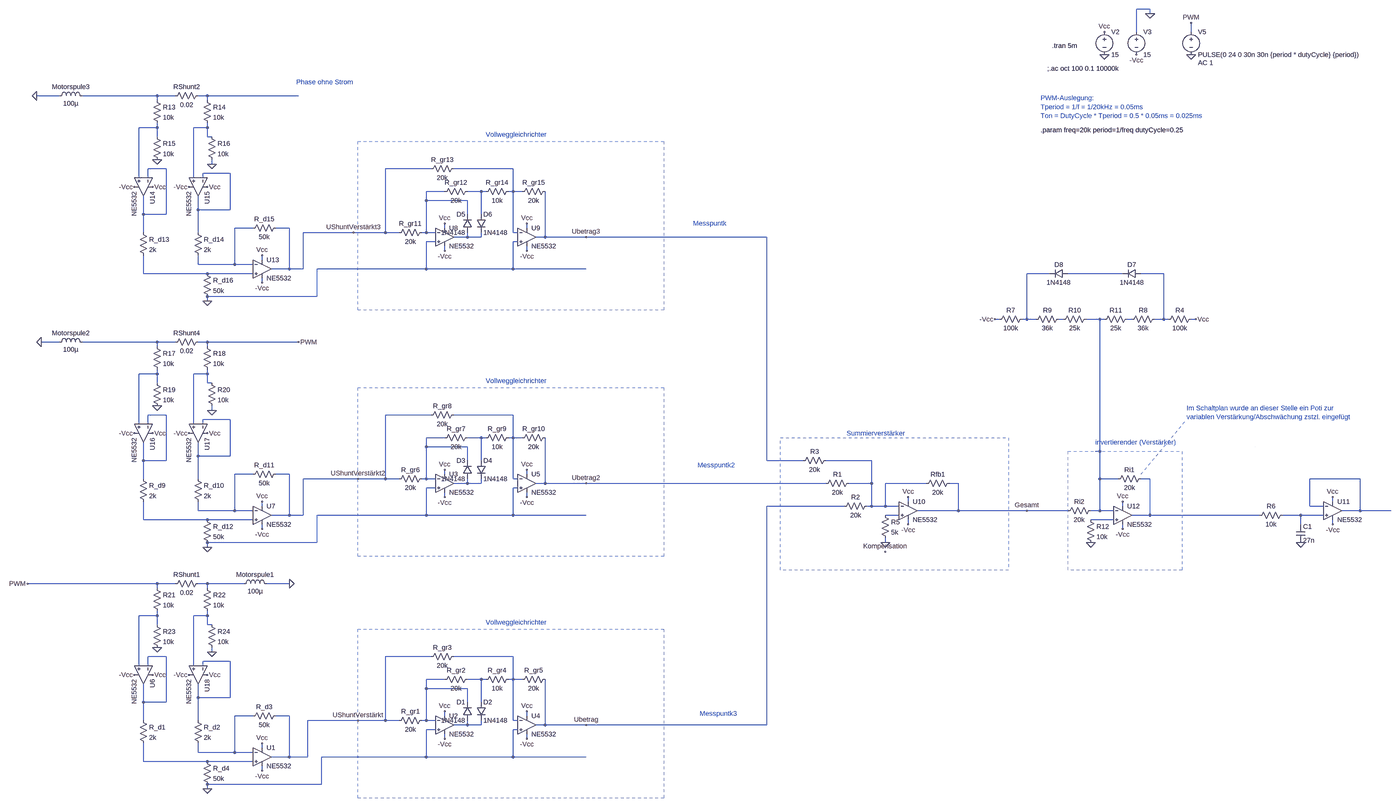
[diagram p0: schematic FullSimulation_MitDifferenzvertärkerVariante2.asc, whole sheet]
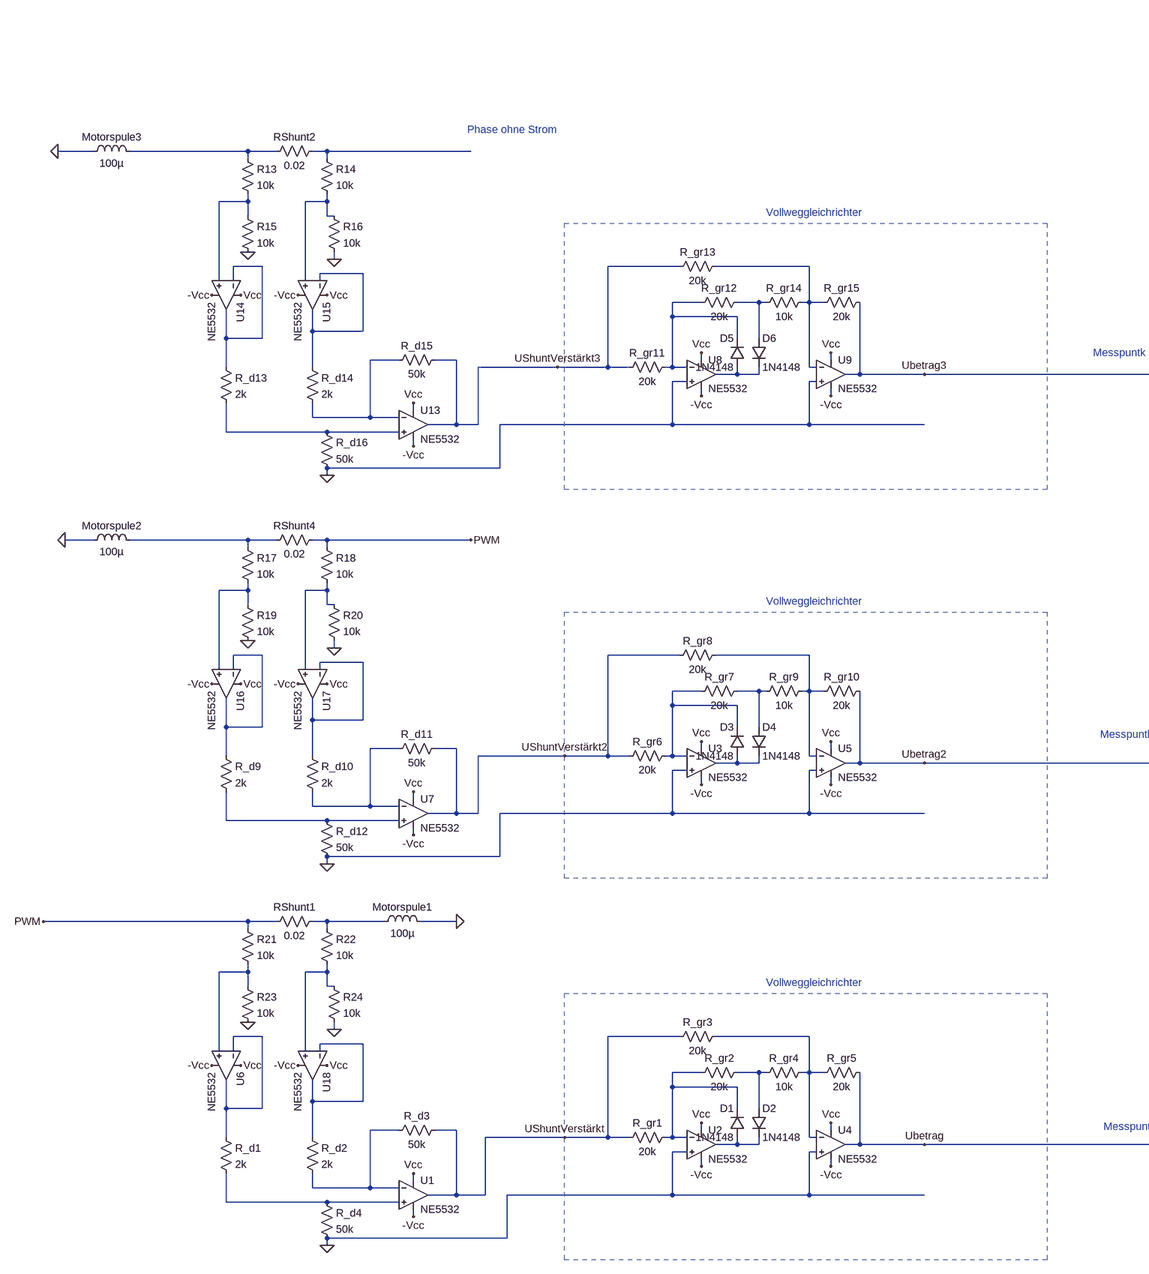
[diagram p1: schematic FullSimulation_MitDifferenzvertärkerVariante2.asc, part, row 1 of 1, column 1 of 2]
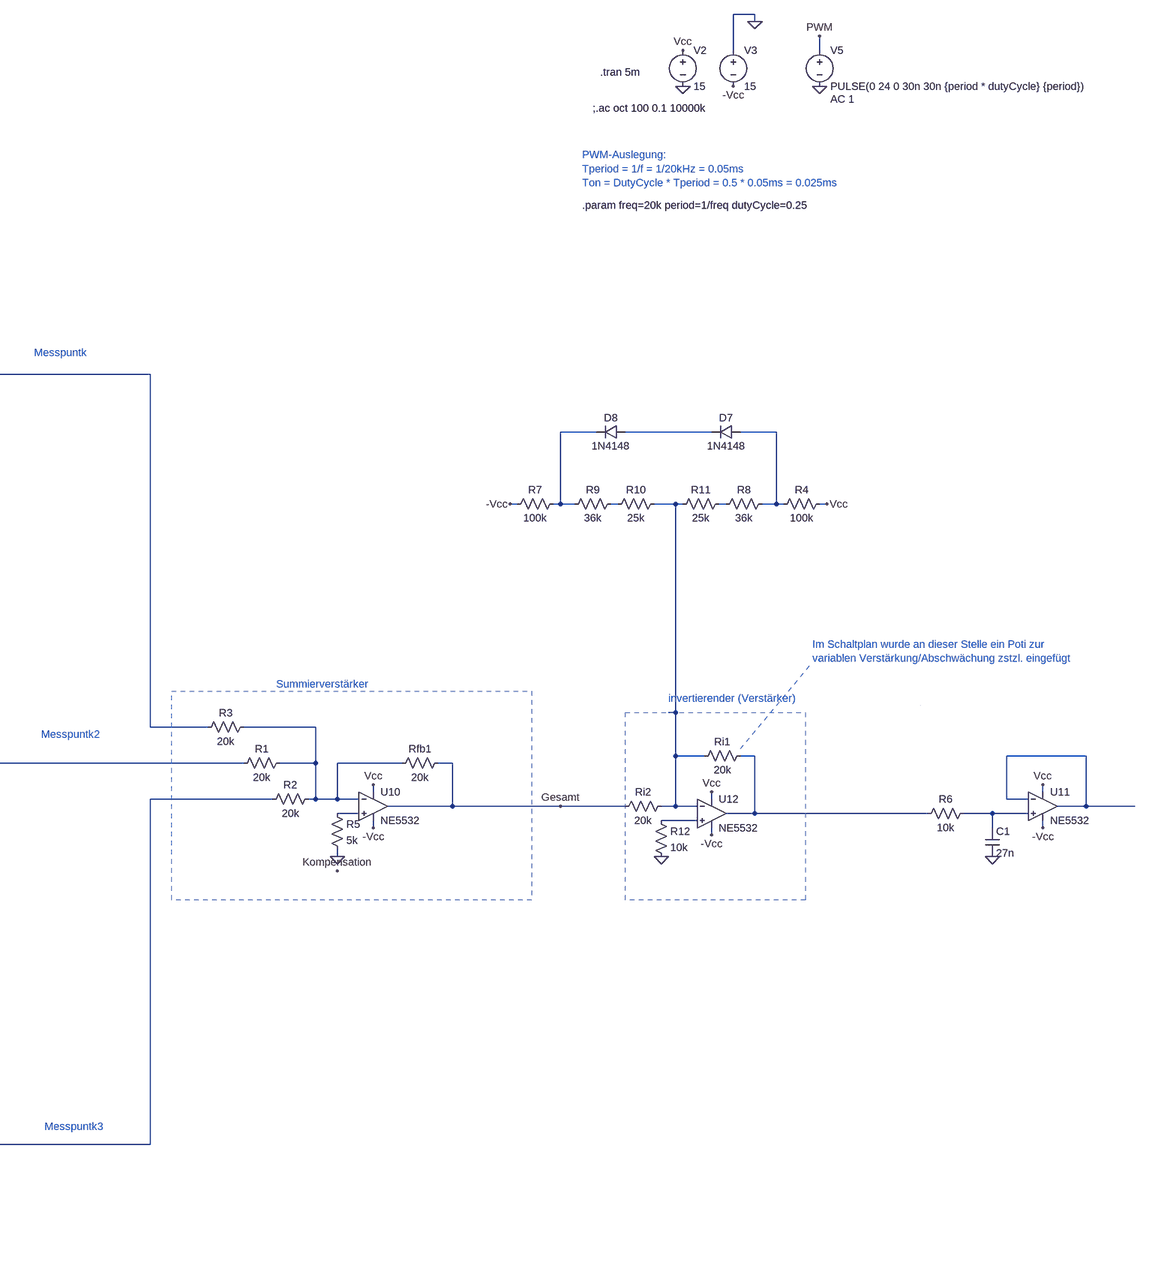
[diagram p2: schematic FullSimulation_MitDifferenzvertärkerVariante2.asc, part, row 1 of 1, column 2 of 2]
FullSimulation_MitDifferenzvertärkerVariante2.asc, the LTspice schematic file:
Version 4
SHEET 1 4728 1104
WIRE 3264 -2192 3216 -2192
WIRE 3264 -2176 3264 -2192
WIRE 3216 -2112 3216 -2192
WIRE 3408 -2112 3408 -2144
WIRE -1264 -1888 -1344 -1888
WIRE -480 -1888 -1184 -1888
WIRE -416 -1888 -480 -1888
WIRE -304 -1888 -336 -1888
WIRE 16 -1888 -304 -1888
WIRE -480 -1872 -480 -1888
WIRE -304 -1872 -304 -1888
WIRE -480 -1776 -480 -1792
WIRE -480 -1776 -544 -1776
WIRE -304 -1776 -304 -1792
WIRE -304 -1776 -352 -1776
WIRE -480 -1744 -480 -1776
WIRE -304 -1744 -304 -1776
WIRE -288 -1744 -304 -1744
WIRE -288 -1648 -288 -1664
WIRE -448 -1632 -512 -1632
WIRE 480 -1632 320 -1632
WIRE 768 -1632 560 -1632
WIRE -224 -1616 -320 -1616
WIRE -544 -1600 -544 -1776
WIRE -512 -1600 -512 -1632
WIRE -352 -1600 -352 -1776
WIRE -320 -1600 -320 -1616
WIRE 528 -1552 464 -1552
WIRE 656 -1552 608 -1552
WIRE 672 -1552 656 -1552
WIRE 768 -1552 768 -1632
WIRE 768 -1552 752 -1552
WIRE 800 -1552 768 -1552
WIRE 464 -1520 464 -1552
WIRE 608 -1520 464 -1520
WIRE -336 -1488 -336 -1536
WIRE -224 -1488 -224 -1616
WIRE -224 -1488 -336 -1488
WIRE -528 -1472 -528 -1536
WIRE -448 -1472 -448 -1632
WIRE -448 -1472 -528 -1472
WIRE 608 -1472 608 -1520
WIRE 656 -1472 656 -1552
WIRE -144 -1424 -208 -1424
WIRE -16 -1424 -64 -1424
WIRE 528 -1424 528 -1440
WIRE 816 -1424 816 -1440
WIRE -528 -1408 -528 -1472
WIRE -336 -1408 -336 -1488
WIRE 208 -1408 32 -1408
WIRE 320 -1408 320 -1632
WIRE 320 -1408 208 -1408
WIRE 368 -1408 320 -1408
WIRE 464 -1408 464 -1520
WIRE 464 -1408 448 -1408
WIRE 496 -1408 464 -1408
WIRE 768 -1408 768 -1552
WIRE 784 -1408 768 -1408
WIRE 608 -1392 608 -1408
WIRE 608 -1392 560 -1392
WIRE 656 -1392 656 -1408
WIRE 656 -1392 608 -1392
WIRE 880 -1392 880 -1552
WIRE 880 -1392 848 -1392
WIRE 1024 -1392 880 -1392
WIRE 1920 -1392 1024 -1392
WIRE 496 -1376 464 -1376
WIRE 784 -1376 768 -1376
WIRE 528 -1344 528 -1360
WIRE 816 -1344 816 -1360
WIRE -112 -1312 -112 -1328
WIRE -336 -1296 -336 -1328
WIRE -208 -1296 -208 -1424
WIRE -208 -1296 -336 -1296
WIRE -144 -1296 -208 -1296
WIRE -16 -1280 -16 -1424
WIRE -16 -1280 -80 -1280
WIRE 32 -1280 32 -1408
WIRE 32 -1280 -16 -1280
WIRE 464 -1280 464 -1376
WIRE 464 -1280 80 -1280
WIRE 768 -1280 768 -1376
WIRE 768 -1280 464 -1280
WIRE 1024 -1280 768 -1280
WIRE -528 -1264 -528 -1328
WIRE -304 -1264 -528 -1264
WIRE -144 -1264 -304 -1264
WIRE 2912 -1264 2832 -1264
WIRE 3168 -1264 2976 -1264
WIRE 3312 -1264 3232 -1264
WIRE -112 -1232 -112 -1248
WIRE 80 -1184 80 -1280
WIRE 80 -1184 -304 -1184
WIRE -304 -1168 -304 -1184
WIRE 2736 -1104 2720 -1104
WIRE 2832 -1104 2832 -1264
WIRE 2832 -1104 2816 -1104
WIRE 2864 -1104 2832 -1104
WIRE 2960 -1104 2944 -1104
WIRE 3088 -1104 3040 -1104
WIRE 3104 -1104 3088 -1104
WIRE 3200 -1104 3184 -1104
WIRE 3312 -1104 3312 -1264
WIRE 3312 -1104 3280 -1104
WIRE 3328 -1104 3312 -1104
WIRE 3424 -1104 3408 -1104
WIRE -1264 -1024 -1328 -1024
WIRE -480 -1024 -1184 -1024
WIRE -416 -1024 -480 -1024
WIRE -304 -1024 -336 -1024
WIRE 16 -1024 -304 -1024
WIRE -480 -1008 -480 -1024
WIRE -304 -1008 -304 -1024
WIRE -480 -912 -480 -928
WIRE -480 -912 -544 -912
WIRE -304 -912 -304 -928
WIRE -304 -912 -352 -912
WIRE -480 -880 -480 -912
WIRE -304 -880 -304 -912
WIRE -288 -880 -304 -880
WIRE -288 -784 -288 -800
WIRE -448 -768 -512 -768
WIRE 480 -768 320 -768
WIRE 768 -768 560 -768
WIRE -224 -752 -320 -752
WIRE -544 -736 -544 -912
WIRE -512 -736 -512 -768
WIRE -352 -736 -352 -912
WIRE -320 -736 -320 -752
WIRE 528 -688 464 -688
WIRE 656 -688 608 -688
WIRE 672 -688 656 -688
WIRE 768 -688 768 -768
WIRE 768 -688 752 -688
WIRE 800 -688 768 -688
WIRE 464 -656 464 -688
WIRE 608 -656 464 -656
WIRE 3088 -640 3088 -1104
WIRE 3088 -640 3072 -640
WIRE -336 -624 -336 -672
WIRE -224 -624 -224 -752
WIRE -224 -624 -336 -624
WIRE -528 -608 -528 -672
WIRE -448 -608 -448 -768
WIRE -448 -608 -528 -608
WIRE 608 -608 608 -656
WIRE 656 -608 656 -688
WIRE 1920 -608 1920 -1392
WIRE 2048 -608 1920 -608
WIRE 2288 -608 2128 -608
WIRE -144 -560 -208 -560
WIRE -16 -560 -64 -560
WIRE 528 -560 528 -576
WIRE 816 -560 816 -576
WIRE -528 -544 -528 -608
WIRE -336 -544 -336 -624
WIRE 224 -544 32 -544
WIRE 320 -544 320 -768
WIRE 320 -544 224 -544
WIRE 368 -544 320 -544
WIRE 464 -544 464 -656
WIRE 464 -544 448 -544
WIRE 496 -544 464 -544
WIRE 768 -544 768 -688
WIRE 784 -544 768 -544
WIRE 3088 -544 3088 -640
WIRE 3152 -544 3088 -544
WIRE 3264 -544 3232 -544
WIRE 4000 -544 3824 -544
WIRE 608 -528 608 -544
WIRE 608 -528 560 -528
WIRE 656 -528 656 -544
WIRE 656 -528 608 -528
WIRE 880 -528 880 -688
WIRE 880 -528 848 -528
WIRE 1024 -528 880 -528
WIRE 2128 -528 1024 -528
WIRE 2288 -528 2288 -608
WIRE 2288 -528 2208 -528
WIRE 2480 -528 2336 -528
WIRE 2592 -528 2560 -528
WIRE 496 -512 464 -512
WIRE 784 -512 768 -512
WIRE 528 -480 528 -496
WIRE 816 -480 816 -496
WIRE 2416 -464 2416 -480
WIRE 3904 -464 3904 -480
WIRE -112 -448 -112 -464
WIRE 2192 -448 1920 -448
WIRE 2288 -448 2288 -528
WIRE 2288 -448 2272 -448
WIRE 2336 -448 2336 -528
WIRE 2336 -448 2288 -448
WIRE 2384 -448 2336 -448
WIRE 3168 -448 3168 -464
WIRE 3824 -448 3824 -544
WIRE 3872 -448 3824 -448
WIRE -336 -432 -336 -464
WIRE -208 -432 -208 -560
WIRE -208 -432 -336 -432
WIRE -144 -432 -208 -432
WIRE 2592 -432 2592 -528
WIRE 2592 -432 2448 -432
WIRE 2832 -432 2592 -432
WIRE 2976 -432 2832 -432
WIRE 3088 -432 3088 -544
WIRE 3088 -432 3056 -432
WIRE 3136 -432 3088 -432
WIRE 4000 -432 4000 -544
WIRE 4000 -432 3936 -432
WIRE 4112 -432 4000 -432
WIRE -16 -416 -16 -560
WIRE -16 -416 -80 -416
WIRE 32 -416 32 -544
WIRE 32 -416 -16 -416
WIRE 464 -416 464 -512
WIRE 464 -416 80 -416
WIRE 768 -416 768 -512
WIRE 768 -416 464 -416
WIRE 1024 -416 768 -416
WIRE 2384 -416 2336 -416
WIRE 3264 -416 3264 -544
WIRE 3264 -416 3200 -416
WIRE 3648 -416 3264 -416
WIRE 3792 -416 3728 -416
WIRE 3872 -416 3792 -416
WIRE -528 -400 -528 -464
WIRE -304 -400 -528 -400
WIRE -144 -400 -304 -400
WIRE 3136 -400 3056 -400
WIRE 2416 -384 2416 -400
WIRE 3792 -384 3792 -416
WIRE 3904 -384 3904 -400
WIRE -112 -368 -112 -384
WIRE 3168 -368 3168 -384
WIRE 80 -320 80 -416
WIRE 80 -320 -304 -320
WIRE 2336 -320 2336 -336
WIRE -304 -304 -304 -320
WIRE -480 -176 -1376 -176
WIRE -416 -176 -480 -176
WIRE -304 -176 -336 -176
WIRE -176 -176 -304 -176
WIRE -16 -176 -96 -176
WIRE -480 -160 -480 -176
WIRE -304 -160 -304 -176
WIRE -480 -64 -480 -80
WIRE -480 -64 -544 -64
WIRE -304 -64 -304 -80
WIRE -304 -64 -352 -64
WIRE -480 -32 -480 -64
WIRE -304 -32 -304 -64
WIRE -288 -32 -304 -32
WIRE -288 64 -288 48
WIRE -448 80 -512 80
WIRE 480 80 320 80
WIRE 768 80 560 80
WIRE -224 96 -320 96
WIRE -544 112 -544 -64
WIRE -512 112 -512 80
WIRE -352 112 -352 -64
WIRE -320 112 -320 96
WIRE 528 160 464 160
WIRE 656 160 608 160
WIRE 672 160 656 160
WIRE 768 160 768 80
WIRE 768 160 752 160
WIRE 800 160 768 160
WIRE 464 192 464 160
WIRE 608 192 464 192
WIRE -336 224 -336 176
WIRE -224 224 -224 96
WIRE -224 224 -336 224
WIRE -528 240 -528 176
WIRE -448 240 -448 80
WIRE -448 240 -528 240
WIRE 608 240 608 192
WIRE 656 240 656 160
WIRE -144 288 -208 288
WIRE -16 288 -64 288
WIRE 528 288 528 272
WIRE 816 288 816 272
WIRE -528 304 -528 240
WIRE -336 304 -336 224
WIRE 224 304 48 304
WIRE 320 304 320 80
WIRE 320 304 224 304
WIRE 368 304 320 304
WIRE 464 304 464 192
WIRE 464 304 448 304
WIRE 496 304 464 304
WIRE 768 304 768 160
WIRE 784 304 768 304
WIRE 608 320 608 304
WIRE 608 320 560 320
WIRE 656 320 656 304
WIRE 656 320 608 320
WIRE 880 320 880 160
WIRE 880 320 848 320
WIRE 1024 320 880 320
WIRE 1920 320 1920 -448
WIRE 1920 320 1024 320
WIRE 496 336 464 336
WIRE 784 336 768 336
WIRE 528 368 528 352
WIRE 816 368 816 352
WIRE -112 400 -112 384
WIRE -336 416 -336 384
WIRE -208 416 -208 288
WIRE -208 416 -336 416
WIRE -144 416 -208 416
WIRE -16 432 -16 288
WIRE -16 432 -80 432
WIRE 48 432 48 304
WIRE 48 432 -16 432
WIRE 464 432 464 336
WIRE 464 432 96 432
WIRE 768 432 768 336
WIRE 768 432 464 432
WIRE 1024 432 768 432
WIRE -528 448 -528 384
WIRE -304 448 -528 448
WIRE -144 448 -304 448
WIRE -112 480 -112 464
WIRE 96 528 96 432
WIRE 96 528 -304 528
WIRE -304 544 -304 528
FLAG 3104 -2032 0
FLAG 3104 -2112 Vcc
FLAG 3216 -2032 -Vcc
FLAG 224 304 UShuntVerstärkt
FLAG 528 368 -Vcc
FLAG 816 368 -Vcc
FLAG 528 272 Vcc
FLAG 816 272 Vcc
FLAG 1024 320 Ubetrag
FLAG -16 -176 0
FLAG 3408 -2032 0
FLAG -1328 -1024 0
FLAG 3408 -2144 PWM
FLAG 224 -544 UShuntVerstärkt2
FLAG 528 -480 -Vcc
FLAG 816 -480 -Vcc
FLAG 528 -576 Vcc
FLAG 816 -576 Vcc
FLAG 1024 -528 Ubetrag2
FLAG -1344 -1888 0
FLAG 208 -1408 UShuntVerstärkt3
FLAG 528 -1344 -Vcc
FLAG 816 -1344 -Vcc
FLAG 528 -1440 Vcc
FLAG 816 -1440 Vcc
FLAG 1024 -1392 Ubetrag3
FLAG 2416 -480 Vcc
FLAG 2416 -384 -Vcc
FLAG 2336 -320 0
FLAG 3168 -464 Vcc
FLAG 3168 -368 -Vcc
FLAG 2336 -288 Kompensation
FLAG 3792 -320 0
FLAG 3904 -480 Vcc
FLAG 3904 -384 -Vcc
FLAG 3424 -1104 Vcc
FLAG 2720 -1104 -Vcc
FLAG 3056 -320 0
FLAG -1376 -176 PWM
FLAG 16 -1024 PWM
FLAG 2832 -432 Gesamt
FLAG 3264 -2176 0
FLAG -304 -1168 0
FLAG -112 -1232 -Vcc
FLAG -112 -1328 Vcc
FLAG -480 -1664 0
FLAG -288 -1648 0
FLAG -496 -1568 Vcc
FLAG -304 -1568 Vcc
FLAG -560 -1568 -Vcc
FLAG -368 -1568 -Vcc
FLAG -304 -304 0
FLAG -112 -368 -Vcc
FLAG -112 -464 Vcc
FLAG -480 -800 0
FLAG -288 -784 0
FLAG -496 -704 Vcc
FLAG -304 -704 Vcc
FLAG -560 -704 -Vcc
FLAG -368 -704 -Vcc
FLAG -304 544 0
FLAG -112 480 -Vcc
FLAG -112 384 Vcc
FLAG -480 48 0
FLAG -288 64 0
FLAG -496 144 Vcc
FLAG -304 144 Vcc
FLAG -560 144 -Vcc
FLAG -368 144 -Vcc
DATAFLAG -720 -176 ""
DATAFLAG 960 320 ""
DATAFLAG -640 -1024 ""
DATAFLAG 960 -528 ""
DATAFLAG -640 -1888 ""
DATAFLAG 48 -1408 ""
DATAFLAG 960 -1392 ""
DATAFLAG 3424 -416 ""
DATAFLAG 2624 -432 ""
DATAFLAG -528 -1328 ""
DATAFLAG -336 -1408 ""
DATAFLAG 48 -544 ""
DATAFLAG -528 -464 ""
DATAFLAG -336 -544 ""
DATAFLAG 48 304 ""
DATAFLAG -528 384 ""
DATAFLAG -336 304 ""
SYMBOL ind -192 -160 R270
WINDOW 0 32 56 VTop 2
WINDOW 3 5 56 VBottom 2
SYMATTR InstName Motorspule1
SYMATTR Value 100µ
SYMATTR SpiceLine Rser=2.38
SYMBOL voltage 3104 -2128 R0
WINDOW 123 0 0 Left 0
WINDOW 39 0 0 Left 0
SYMATTR InstName V2
SYMATTR Value 15
SYMBOL voltage 3216 -2128 R0
WINDOW 123 0 0 Left 0
WINDOW 39 0 0 Left 0
SYMATTR InstName V3
SYMATTR Value 15
SYMBOL res 464 288 R90
WINDOW 0 0 56 VBottom 2
WINDOW 3 32 56 VTop 2
SYMATTR InstName R_gr1
SYMATTR Value 20k
SYMBOL diode 624 304 R180
WINDOW 0 24 64 Left 2
WINDOW 3 24 0 Left 2
SYMATTR InstName D1
SYMATTR Value 1N4148
SYMBOL diode 640 240 R0
SYMATTR InstName D2
SYMATTR Value 1N4148
SYMBOL res 624 144 R90
WINDOW 0 0 56 VBottom 2
WINDOW 3 32 56 VTop 2
SYMATTR InstName R_gr2
SYMATTR Value 20k
SYMBOL res 576 64 R90
WINDOW 0 0 56 VBottom 2
WINDOW 3 32 56 VTop 2
SYMATTR InstName R_gr3
SYMATTR Value 20k
SYMBOL res 768 144 R90
WINDOW 0 0 56 VBottom 2
WINDOW 3 32 56 VTop 2
SYMATTR InstName R_gr4
SYMATTR Value 10k
SYMBOL res 896 144 R90
WINDOW 0 0 56 VBottom 2
WINDOW 3 32 56 VTop 2
SYMATTR InstName R_gr5
SYMATTR Value 20k
SYMBOL ind -1168 -1008 M270
WINDOW 0 32 56 VTop 2
WINDOW 3 5 56 VBottom 2
SYMATTR InstName Motorspule2
SYMATTR Value 100µ
SYMATTR SpiceLine Rser=2.38
SYMBOL res 464 -560 R90
WINDOW 0 0 56 VBottom 2
WINDOW 3 32 56 VTop 2
SYMATTR InstName R_gr6
SYMATTR Value 20k
SYMBOL diode 624 -544 R180
WINDOW 0 24 64 Left 2
WINDOW 3 24 0 Left 2
SYMATTR InstName D3
SYMATTR Value 1N4148
SYMBOL diode 640 -608 R0
SYMATTR InstName D4
SYMATTR Value 1N4148
SYMBOL res 624 -704 R90
WINDOW 0 0 56 VBottom 2
WINDOW 3 32 56 VTop 2
SYMATTR InstName R_gr7
SYMATTR Value 20k
SYMBOL res 576 -784 R90
WINDOW 0 0 56 VBottom 2
WINDOW 3 32 56 VTop 2
SYMATTR InstName R_gr8
SYMATTR Value 20k
SYMBOL res 768 -704 R90
WINDOW 0 0 56 VBottom 2
WINDOW 3 32 56 VTop 2
SYMATTR InstName R_gr9
SYMATTR Value 10k
SYMBOL res 896 -704 R90
WINDOW 0 0 56 VBottom 2
WINDOW 3 32 56 VTop 2
SYMATTR InstName R_gr10
SYMATTR Value 20k
SYMBOL voltage 3408 -2128 R0
WINDOW 123 24 124 Left 2
WINDOW 39 0 0 Left 0
SYMATTR Value2 AC 1
SYMATTR InstName V5
SYMATTR Value PULSE(0 24 0 30n 30n {period * dutyCycle} {period})
SYMBOL ind -1168 -1872 M270
WINDOW 0 32 56 VTop 2
WINDOW 3 5 56 VBottom 2
SYMATTR InstName Motorspule3
SYMATTR Value 100µ
SYMATTR SpiceLine Rser=2.38
SYMBOL res -320 -1904 R90
WINDOW 0 0 56 VBottom 2
WINDOW 3 32 56 VTop 2
SYMATTR InstName RShunt2
SYMATTR Value 0.02
SYMBOL res 464 -1424 R90
WINDOW 0 0 56 VBottom 2
WINDOW 3 32 56 VTop 2
SYMATTR InstName R_gr11
SYMATTR Value 20k
SYMBOL diode 624 -1408 R180
WINDOW 0 24 64 Left 2
WINDOW 3 24 0 Left 2
SYMATTR InstName D5
SYMATTR Value 1N4148
SYMBOL diode 640 -1472 R0
SYMATTR InstName D6
SYMATTR Value 1N4148
SYMBOL res 624 -1568 R90
WINDOW 0 0 56 VBottom 2
WINDOW 3 32 56 VTop 2
SYMATTR InstName R_gr12
SYMATTR Value 20k
SYMBOL res 576 -1648 R90
WINDOW 0 0 56 VBottom 2
WINDOW 3 32 56 VTop 2
SYMATTR InstName R_gr13
SYMATTR Value 20k
SYMBOL res 768 -1568 R90
WINDOW 0 0 56 VBottom 2
WINDOW 3 32 56 VTop 2
SYMATTR InstName R_gr14
SYMATTR Value 10k
SYMBOL res 896 -1568 R90
WINDOW 0 0 56 VBottom 2
WINDOW 3 32 56 VTop 2
SYMATTR InstName R_gr15
SYMATTR Value 20k
SYMBOL res 2576 -544 R90
WINDOW 0 0 56 VBottom 2
WINDOW 3 32 56 VTop 2
SYMATTR InstName Rfb1
SYMATTR Value 20k
SYMBOL res 2224 -544 R90
WINDOW 0 0 56 VBottom 2
WINDOW 3 32 56 VTop 2
SYMATTR InstName R1
SYMATTR Value 20k
SYMBOL res 2288 -464 R90
WINDOW 0 0 56 VBottom 2
WINDOW 3 32 56 VTop 2
SYMATTR InstName R2
SYMATTR Value 20k
SYMBOL res 2144 -624 R90
WINDOW 0 0 56 VBottom 2
WINDOW 3 32 56 VTop 2
SYMATTR InstName R3
SYMATTR Value 20k
SYMBOL res 3248 -560 R90
WINDOW 0 0 56 VBottom 2
WINDOW 3 32 56 VTop 2
SYMATTR InstName Ri1
SYMATTR Value 20k
SYMBOL res 3072 -448 R90
WINDOW 0 0 56 VBottom 2
WINDOW 3 32 56 VTop 2
SYMATTR InstName Ri2
SYMATTR Value 20k
SYMBOL res 3744 -432 R90
WINDOW 0 0 56 VBottom 2
WINDOW 3 32 56 VTop 2
SYMATTR InstName R6
SYMATTR Value 10k
SYMBOL cap 3776 -384 R0
SYMATTR InstName C1
SYMATTR Value 27n
SYMBOL NE5532 3904 -496 R0
SYMATTR InstName U11
SYMBOL NE5532 528 -1456 R0
SYMATTR InstName U8
SYMBOL NE5532 816 -1456 R0
SYMATTR InstName U9
SYMBOL NE5532 528 -592 R0
SYMATTR InstName U3
SYMBOL NE5532 816 -592 R0
SYMATTR InstName U5
SYMBOL NE5532 528 256 R0
SYMATTR InstName U2
SYMBOL NE5532 816 256 R0
SYMATTR InstName U4
SYMBOL NE5532 2416 -496 R0
SYMATTR InstName U10
SYMBOL NE5532 3168 -480 R0
SYMATTR InstName U12
SYMBOL res 2320 -432 R0
SYMATTR InstName R5
SYMATTR Value 5k
SYMBOL res 3312 -1088 R270
WINDOW 0 32 56 VTop 2
WINDOW 3 0 56 VBottom 2
SYMATTR InstName R4
SYMATTR Value 100k
SYMBOL res 2720 -1088 R270
WINDOW 0 32 56 VTop 2
WINDOW 3 0 56 VBottom 2
SYMATTR InstName R7
SYMATTR Value 100k
SYMBOL res 3184 -1088 R270
WINDOW 0 32 56 VTop 2
WINDOW 3 0 56 VBottom 2
SYMATTR InstName R8
SYMATTR Value 36k
SYMBOL res 2848 -1088 R270
WINDOW 0 32 56 VTop 2
WINDOW 3 0 56 VBottom 2
SYMATTR InstName R9
SYMATTR Value 36k
SYMBOL res 2944 -1088 R270
WINDOW 0 32 56 VTop 2
WINDOW 3 0 56 VBottom 2
SYMATTR InstName R10
SYMATTR Value 25k
SYMBOL res 3088 -1088 R270
WINDOW 0 32 56 VTop 2
WINDOW 3 0 56 VBottom 2
SYMATTR InstName R11
SYMATTR Value 25k
SYMBOL diode 3232 -1280 R90
WINDOW 0 0 32 VBottom 2
WINDOW 3 32 32 VTop 2
SYMATTR InstName D7
SYMATTR Value 1N4148
SYMBOL diode 2976 -1280 R90
WINDOW 0 0 32 VBottom 2
WINDOW 3 32 32 VTop 2
SYMATTR InstName D8
SYMATTR Value 1N4148
SYMBOL res 3040 -416 R0
SYMATTR InstName R12
SYMATTR Value 10k
SYMBOL res -496 -1888 R0
SYMATTR InstName R13
SYMATTR Value 10k
SYMBOL res -320 -1888 R0
SYMATTR InstName R14
SYMATTR Value 10k
SYMBOL res -544 -1424 R0
SYMATTR InstName R_d13
SYMATTR Value 2k
SYMBOL res -352 -1424 R0
SYMATTR InstName R_d14
SYMATTR Value 2k
SYMBOL res -48 -1440 R90
WINDOW 0 0 56 VBottom 2
WINDOW 3 32 56 VTop 2
SYMATTR InstName R_d15
SYMATTR Value 50k
SYMBOL res -320 -1280 R0
SYMATTR InstName R_d16
SYMATTR Value 50k
SYMBOL res -496 -1760 R0
SYMATTR InstName R15
SYMATTR Value 10k
SYMBOL res -304 -1760 R0
SYMATTR InstName R16
SYMATTR Value 10k
SYMBOL NE5532 -112 -1344 R0
SYMATTR InstName U13
SYMBOL NE5532 -464 -1568 R90
SYMATTR InstName U14
SYMBOL NE5532 -272 -1568 R90
SYMATTR InstName U15
SYMBOL res -320 -1040 R90
WINDOW 0 0 56 VBottom 2
WINDOW 3 32 56 VTop 2
SYMATTR InstName RShunt4
SYMATTR Value 0.02
SYMBOL res -496 -1024 R0
SYMATTR InstName R17
SYMATTR Value 10k
SYMBOL res -320 -1024 R0
SYMATTR InstName R18
SYMATTR Value 10k
SYMBOL res -544 -560 R0
SYMATTR InstName R_d9
SYMATTR Value 2k
SYMBOL res -352 -560 R0
SYMATTR InstName R_d10
SYMATTR Value 2k
SYMBOL res -48 -576 R90
WINDOW 0 0 56 VBottom 2
WINDOW 3 32 56 VTop 2
SYMATTR InstName R_d11
SYMATTR Value 50k
SYMBOL res -320 -416 R0
SYMATTR InstName R_d12
SYMATTR Value 50k
SYMBOL res -496 -896 R0
SYMATTR InstName R19
SYMATTR Value 10k
SYMBOL res -304 -896 R0
SYMATTR InstName R20
SYMATTR Value 10k
SYMBOL NE5532 -112 -480 R0
SYMATTR InstName U7
SYMBOL NE5532 -464 -704 R90
SYMATTR InstName U16
SYMBOL NE5532 -272 -704 R90
SYMATTR InstName U17
SYMBOL res -320 -192 R90
WINDOW 0 0 56 VBottom 2
WINDOW 3 32 56 VTop 2
SYMATTR InstName RShunt1
SYMATTR Value 0.02
SYMBOL res -496 -176 R0
SYMATTR InstName R21
SYMATTR Value 10k
SYMBOL res -320 -176 R0
SYMATTR InstName R22
SYMATTR Value 10k
SYMBOL res -544 288 R0
SYMATTR InstName R_d1
SYMATTR Value 2k
SYMBOL res -352 288 R0
SYMATTR InstName R_d2
SYMATTR Value 2k
SYMBOL res -48 272 R90
WINDOW 0 0 56 VBottom 2
WINDOW 3 32 56 VTop 2
SYMATTR InstName R_d3
SYMATTR Value 50k
SYMBOL res -320 432 R0
SYMATTR InstName R_d4
SYMATTR Value 50k
SYMBOL res -496 -48 R0
SYMATTR InstName R23
SYMATTR Value 10k
SYMBOL res -304 -48 R0
SYMATTR InstName R24
SYMATTR Value 10k
SYMBOL NE5532 -112 368 R0
SYMATTR InstName U1
SYMBOL NE5532 -464 144 R90
SYMATTR InstName U6
SYMBOL NE5532 -272 144 R90
SYMATTR InstName U18
TEXT 2920 -2064 Left 2 !.tran 5m
TEXT 2880 -1880 Left 2 ;PWM-Auslegung:\nTperiod = 1/f = 1/20kHz = 0.05ms\nTon = DutyCycle * Tperiod = 0.5 * 0.05ms = 0.025ms
TEXT 672 -40 Left 2 ;Vollweggleichrichter
TEXT 672 -888 Left 2 ;Vollweggleichrichter
TEXT 672 -1752 Left 2 ;Vollweggleichrichter
TEXT 2200 -704 Left 2 ;Summierverstärker
TEXT 3072 -672 Left 2 ;invertierender (Verstärker)
TEXT 2880 -1768 Left 2 !.param freq=20k period=1/freq dutyCycle=0.25
TEXT 1560 -1440 Left 2 ;Messpuntk
TEXT 1576 -592 Left 2 ;Messpuntk2
TEXT 1584 280 Left 2 ;Messpuntk3
TEXT 2904 -1984 Left 2 !;.ac oct 100 0.1 10000k
TEXT 3392 -792 Left 2 ;Im Schaltplan wurde an dieser Stelle ein Poti zur \nvariablen Verstärkung/Abschwächung zstzl. eingefügt
TEXT 8 -1936 Left 2 ;Phase ohne Strom
LINE Normal 3232 -560 3392 -752 2
LINE Normal 3632 -656 3632 -656 2
RECTANGLE Normal 1296 576 224 -16 1
RECTANGLE Normal 1296 -272 224 -864 1
RECTANGLE Normal 1296 -1136 224 -1728 1
RECTANGLE Normal 2768 -224 1968 -688 2
RECTANGLE Normal 3376 -224 2976 -640 2

The netlist it stands for:
* FullSimulation_MitDifferenzvertärkerVariante2.asc
L§Motorspule1 N036 0 100µ Rser=2.38
V2 Vcc 0 15
V3 0 -Vcc 15
R_gr1 N042 UShuntVerstärkt 20k
D1 N045 N042 1N4148
D2 N043 N045 1N4148
R_gr2 N043 N042 20k
R_gr3 N040 UShuntVerstärkt 20k
R_gr4 N040 N043 10k
R_gr5 Ubetrag N040 20k
L§Motorspule2 N019 0 100µ Rser=2.38
R_gr6 N025 UShuntVerstärkt2 20k
D3 N031 N025 1N4148
D4 N026 N031 1N4148
R_gr7 N026 N025 20k
R_gr8 N023 UShuntVerstärkt2 20k
R_gr9 N023 N026 10k
R_gr10 Ubetrag2 N023 20k
V5 PWM 0 PULSE(0 24 0 30n 30n {period * dutyCycle} {period}) AC 1
L§Motorspule3 N001 0 100µ Rser=2.38
RShunt2 N002 N001 0.02
R_gr11 N008 UShuntVerstärkt3 20k
D5 N011 N008 1N4148
D6 N009 N011 1N4148
R_gr12 N009 N008 20k
R_gr13 N006 UShuntVerstärkt3 20k
R_gr14 N006 N009 10k
R_gr15 Ubetrag3 N006 20k
Rfb1 Gesamt N027 20k
R1 N027 Ubetrag2 20k
R2 N027 Ubetrag 20k
R3 N027 Ubetrag3 20k
Ri1 N029 N017 20k
Ri2 N017 Gesamt 20k
R6 N033 N029 10k
C1 N033 0 27n
* U11: NE5532 (symbol NE5532 not available, pins judged from their places): In+=N033 In-=N030 V+=Vcc V-=-Vcc OUT=N030
* U8: NE5532 (symbol NE5532 not available, pins judged from their places): In+=0 In-=N008 V+=Vcc V-=-Vcc OUT=N011
* U9: NE5532 (symbol NE5532 not available, pins judged from their places): In+=0 In-=N006 V+=Vcc V-=-Vcc OUT=Ubetrag3
* U3: NE5532 (symbol NE5532 not available, pins judged from their places): In+=0 In-=N025 V+=Vcc V-=-Vcc OUT=N031
* U5: NE5532 (symbol NE5532 not available, pins judged from their places): In+=0 In-=N023 V+=Vcc V-=-Vcc OUT=Ubetrag2
* U2: NE5532 (symbol NE5532 not available, pins judged from their places): In+=0 In-=N042 V+=Vcc V-=-Vcc OUT=N045
* U4: NE5532 (symbol NE5532 not available, pins judged from their places): In+=0 In-=N040 V+=Vcc V-=-Vcc OUT=Ubetrag
* U10: NE5532 (symbol NE5532 not available, pins judged from their places): In+=N032 In-=N027 V+=Vcc V-=-Vcc OUT=Gesamt
* U12: NE5532 (symbol NE5532 not available, pins judged from their places): In+=N035 In-=N017 V+=Vcc V-=-Vcc OUT=N029
R5 N032 0 5k
R4 N015 Vcc 100k
R7 -Vcc N013 100k
R8 N018 N015 36k
R9 N013 N016 36k
R10 N016 N017 25k
R11 N017 N018 25k
D7 N015 N014 1N4148
D8 N014 N013 1N4148
R12 N035 0 10k
R13 N001 N003 10k
R14 N002 N004 10k
R_d13 N005 N012 2k
R_d14 N007 N010 2k
R_d15 UShuntVerstärkt3 N010 50k
R_d16 N012 0 50k
R15 N003 0 10k
R16 N004 0 10k
* U13: NE5532 (symbol NE5532 not available, pins judged from their places): In+=N012 In-=N010 V+=Vcc V-=-Vcc OUT=UShuntVerstärkt3
* U14: NE5532 (symbol NE5532 not available, pins judged from their places): In+=N003 In-=N005 V+=Vcc V-=-Vcc OUT=N005
* U15: NE5532 (symbol NE5532 not available, pins judged from their places): In+=N004 In-=N007 V+=Vcc V-=-Vcc OUT=N007
RShunt4 PWM N019 0.02
R17 N019 N020 10k
R18 PWM N021 10k
R_d9 N022 N034 2k
R_d10 N024 N028 2k
R_d11 UShuntVerstärkt2 N028 50k
R_d12 N034 0 50k
R19 N020 0 10k
R20 N021 0 10k
* U7: NE5532 (symbol NE5532 not available, pins judged from their places): In+=N034 In-=N028 V+=Vcc V-=-Vcc OUT=UShuntVerstärkt2
* U16: NE5532 (symbol NE5532 not available, pins judged from their places): In+=N020 In-=N022 V+=Vcc V-=-Vcc OUT=N022
* U17: NE5532 (symbol NE5532 not available, pins judged from their places): In+=N021 In-=N024 V+=Vcc V-=-Vcc OUT=N024
RShunt1 N036 PWM 0.02
R21 PWM N037 10k
R22 N036 N038 10k
R_d1 N039 N046 2k
R_d2 N041 N044 2k
R_d3 UShuntVerstärkt N044 50k
R_d4 N046 0 50k
R23 N037 0 10k
R24 N038 0 10k
* U1: NE5532 (symbol NE5532 not available, pins judged from their places): In+=N046 In-=N044 V+=Vcc V-=-Vcc OUT=UShuntVerstärkt
* U6: NE5532 (symbol NE5532 not available, pins judged from their places): In+=N037 In-=N039 V+=Vcc V-=-Vcc OUT=N039
* U18: NE5532 (symbol NE5532 not available, pins judged from their places): In+=N038 In-=N041 V+=Vcc V-=-Vcc OUT=N041
.model D D
.lib standard.dio
.tran 5m
* PWM-Auslegung:
* Tperiod = 1/f = 1/20kHz = 0.05ms
* Ton = DutyCycle * Tperiod = 0.5 * 0.05ms = 0.025ms
* Vollweggleichrichter
* Vollweggleichrichter
* Vollweggleichrichter
* Summierverstärker
* invertierender (Verstärker)
.param freq=20k period=1/freq dutyCycle=0.25
* Messpuntk
* Messpuntk2
* Messpuntk3
;.ac oct 100 0.1 10000k
* Im Schaltplan wurde an dieser Stelle ein Poti zur
* variablen Verstärkung/Abschwächung zstzl. eingefügt
* Phase ohne Strom
.backanno
.end